# EAGLE design baza (EAGLE 6.1)
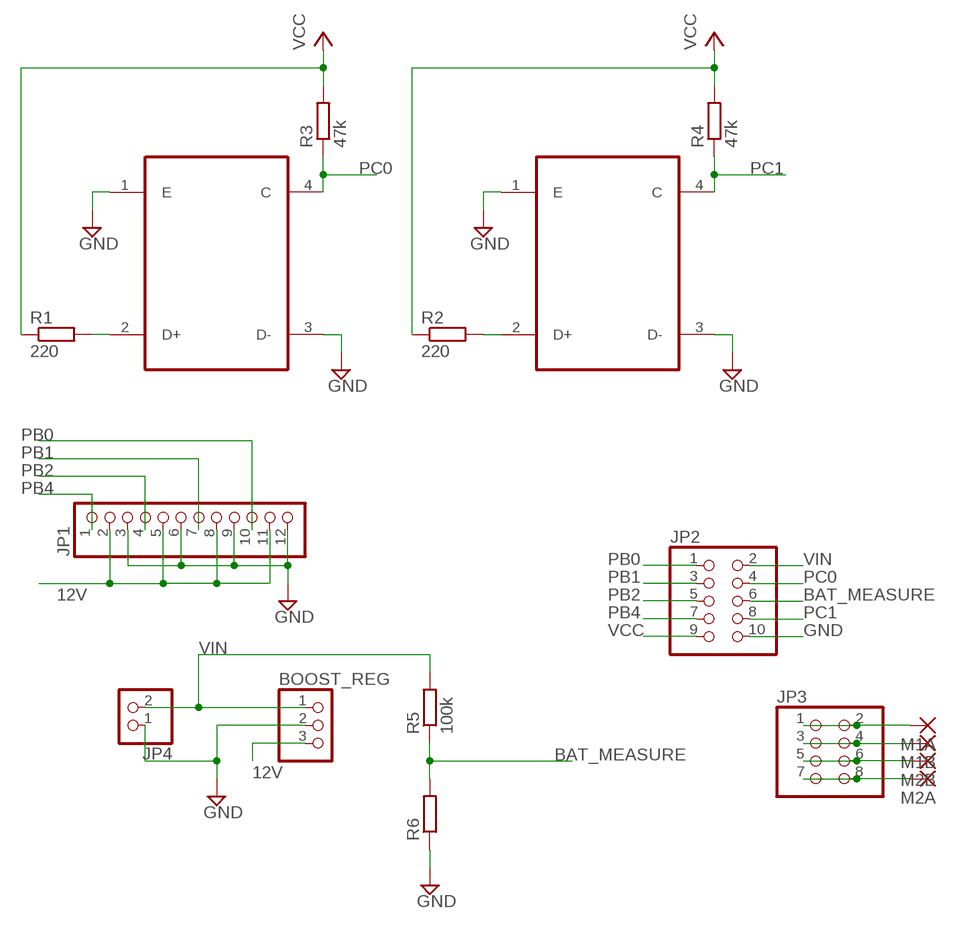
[diagram p0: schematic, sheet 1]

## Parts
BOOST_REG  PINHD-1X3  [1X03]
IR1  TCNT2000  [TCNT2000]
IR2  TCNT2000  [TCNT2000]
JP1  PINHD-1X12-CB  [1X12-CB]
JP2  PINHD-2X5  [2X05]
JP3  PINHD-2X4  [2X04]
JP4  PINHD-1X2  [1X02]
M1A  2,15/1,0  [2,15/1,0]
M1B  2,15/1,0  [2,15/1,0]
M2A  2,15/1,0  [2,15/1,0]
M2B  2,15/1,0  [2,15/1,0]
R1  220  R-EU_M1206  [M1206]
R2  220  R-EU_M1206  [M1206]
R3  47k  R-EU_M1206  [M1206]
R4  47k  R-EU_M1206  [M1206]
R5  100k  R-EU_R1206  [R1206]
R6  R-EU_R1206  [R1206]

## Nets
12V: BOOST_REG.3 JP1.2 JP1.5 JP1.8 JP1.11
BAT_MEASURE: JP2.6 R5.1 R6.2
GND: BOOST_REG.2 IR1.1(E) IR1.3(D-) IR2.1(E) IR2.3(D-) JP1.3 JP1.6 JP1.9 JP1.12 JP2.10 JP4.1 R6.1
N$1: IR1.2(D+) R1.2
N$3: JP3.1 JP3.2 M1A.1(P)
N$4: IR2.2(D+) R2.2
N$5: JP3.3 JP3.4 M1B.1(P)
N$6: JP3.5 JP3.6 M2B.1(P)
N$7: JP3.7 JP3.8 M2A.1(P)
PB0: JP1.10 JP2.1
PB1: JP1.7 JP2.3
PB2: JP1.4 JP2.5
PB4: JP1.1 JP2.7
PC0: IR1.4(C) JP2.4 R3.1
PC1: IR2.4(C) JP2.8 R4.1
VCC: JP2.9 R1.1 R2.1 R3.2 R4.2
VIN: BOOST_REG.1 JP2.2 JP4.2 R5.2

## Library data of the parts
BOOST_REG = adafruit:PINHD-1X3: PIN HEADER
IR1 IR2 = TCNT2000:TCNT2000: The TCNT2000 is a reflective sensor in a miniature SMD package. It has a compact construction where the emitting light source and the detector are arranged in the same plane FEATURES • Package type: SMD • Detector type: phototransistor • Dimensions (L x W x H in mm): 3.4 x 2.7 x 1.5 • Operating range within > 20 % relative collector current: 0.2 mm to 5 mm • Emitter wavelength: 940 nm • Moisture sensitivity level (MSL): 3 APPLICATIONS • Position sensor • Optical switch • Optical encoder (e.g. disc and tape drives for DVD and/or camera applications) • Object detection (e.g. paper presence in printer and copy machines)
JP1 = adafruit:PINHD-1X12: PIN HEADER
JP2 = pinhead:PINHD-2X5: PIN HEADER
JP3 = pinhead:PINHD-2X4: PIN HEADER
JP4 = pinhead:PINHD-1X2: PIN HEADER
M1A M1B M2A M2B = wirepad:2,15/1,0: THROUGH-HOLE PAD
R1-R6 = resistor:R-EU_: RESISTOR, European symbol

## Board
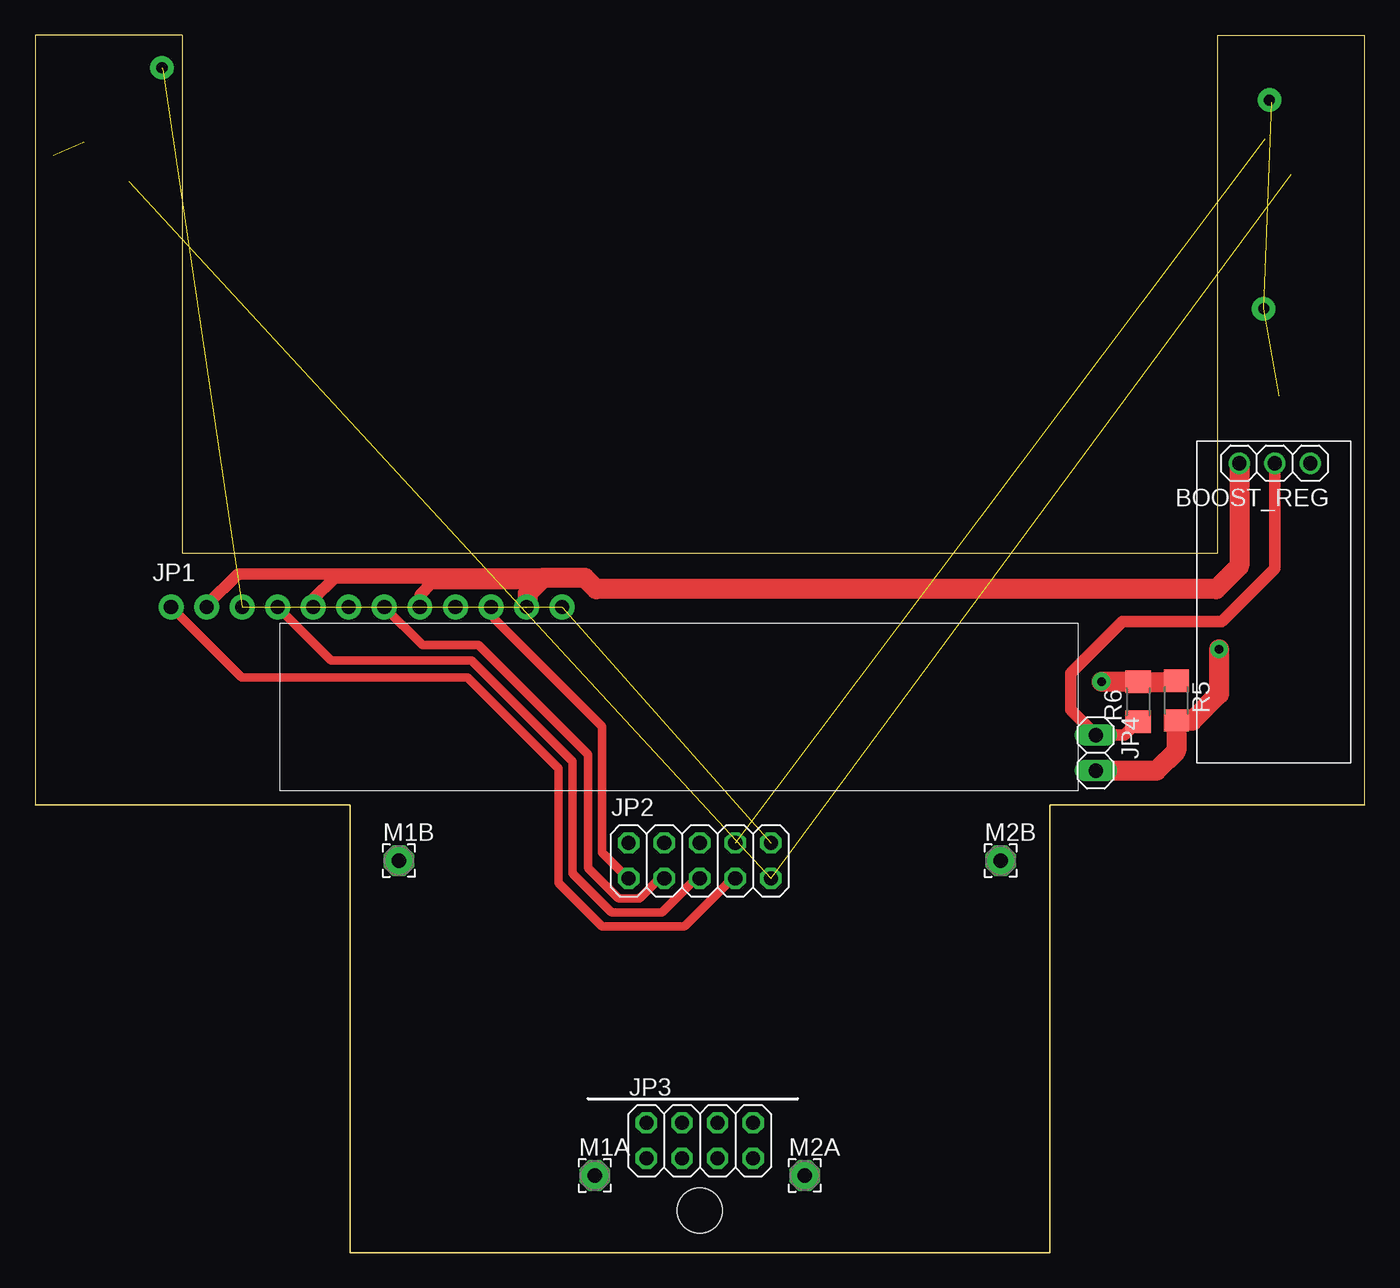
[diagram p1: board, top side]
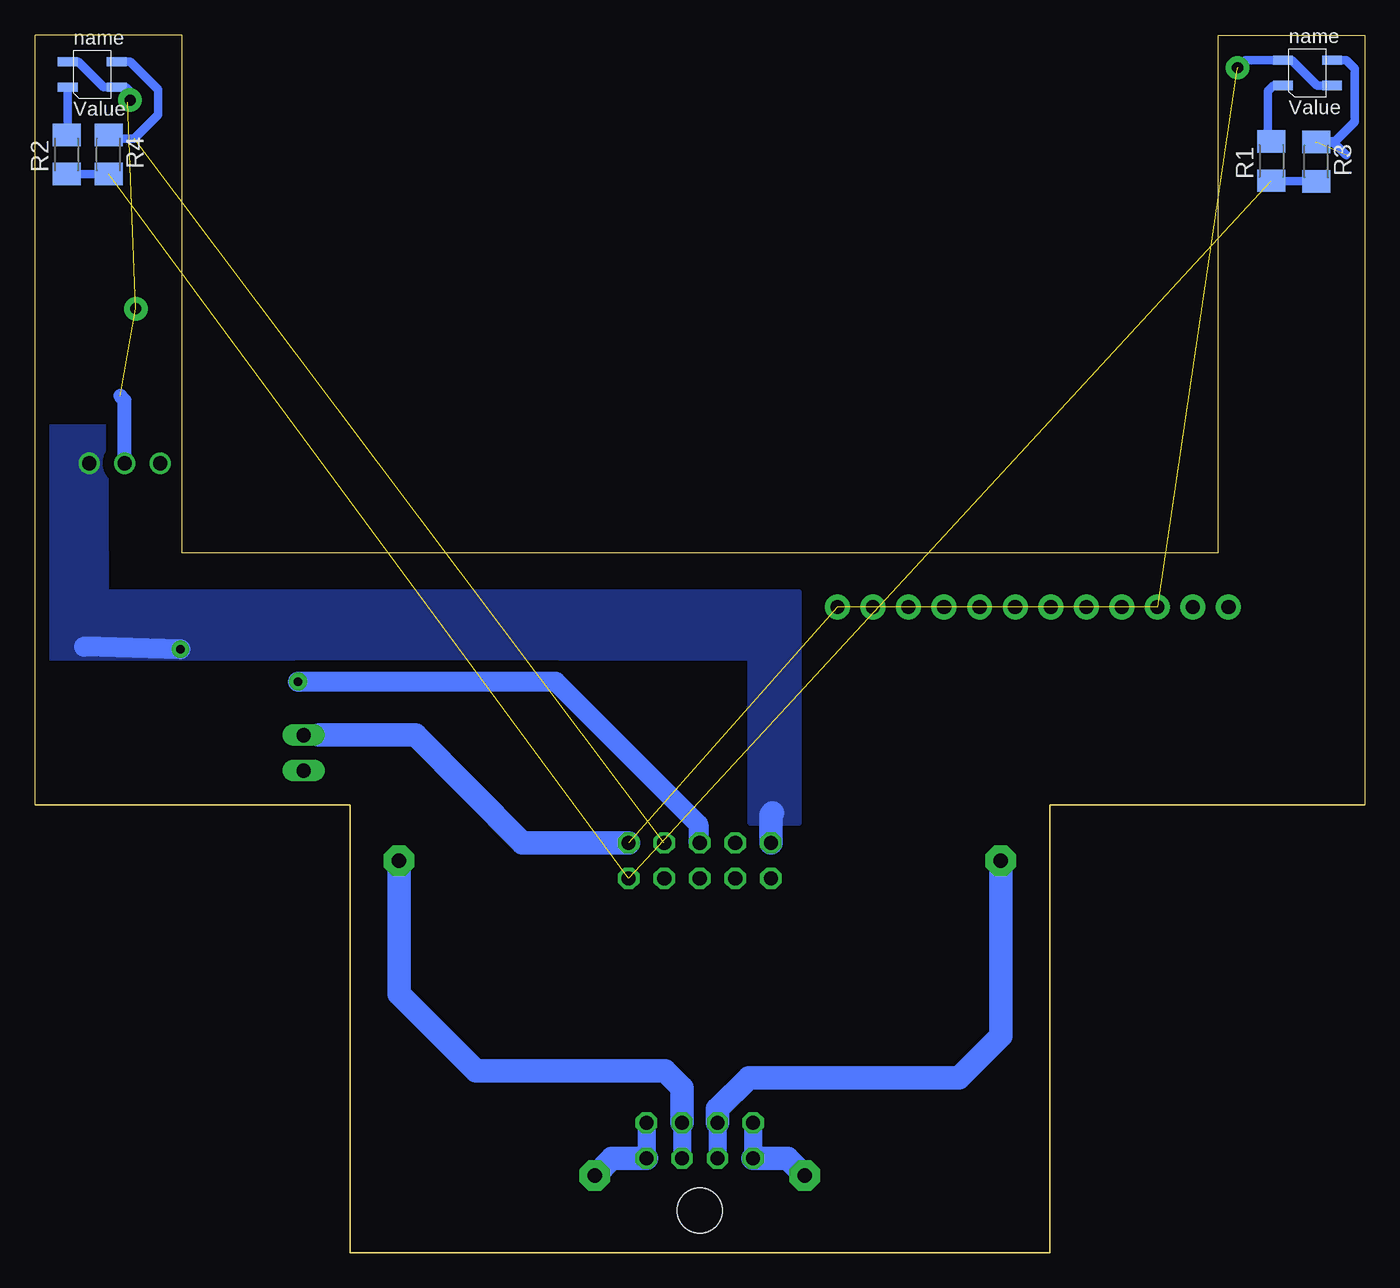
[diagram p2: board, bottom side, seen from below]

Size 95 x 87 mm. Coordinates in mm from the lower left corner, seen from the top.
Outline: 95,32 95,87 84.5,87 84.5,50 10.5,50 10.5,87 0,87 0,32 22.5,32 22.5,0 72.5,0 72.5,32 95,32
Copper layers (1*16): Top 0.035mm / dielectric 1.5mm / Bottom 0.035mm
Design rules: minimum track width 10mil, minimum drill 24mil, track to track 8mil, track to pad 8mil, pad to pad 8mil, via to via 8mil, smd to smd 8mil, copper to edge 40mil, drill to drill 8mil, minimum pad ring 10mil, minimum via ring 8mil, stop-mask expansion 4mil, vias tented up to drill 0mil, thermal gap 10mil
Holes 3.2 mm at 47.5,3

### Footprints (pad centres in the part's own frame; a part is rotated, then mirrored left to right if it is on the bottom)
1X03 = drill 1.016: 1 -2.54,0; 2 0,0; 3 2.54,0
TCNT2000 = smd 1.4 x 0.65: 1 -1.67,1.33; 2 -1.67,-0.47; 3 1.83,-0.47; 4 1.83,1.33
1X12-CB = drill 1.016 pad 1.778: 1 -13.97,0; 2 -11.43,0; 3 -8.89,0; 4 -6.35,0; 5 -3.81,0; 6 -1.27,0; 7 1.27,0; 8 3.81,0; 9 6.35,0; 10 8.89,0; 11 11.43,0; 12 13.97,0
2X05 = drill 1.016 octagon: 1 -5.08,-1.27; 2 -5.08,1.27; 3 -2.54,-1.27; 4 -2.54,1.27; 5 0,-1.27; 6 0,1.27; 7 2.54,-1.27; 8 2.54,1.27; 9 5.08,-1.27; 10 5.08,1.27
2X04 = drill 1.016 octagon: 1 -3.81,-1.27; 2 -3.81,1.27; 3 -1.27,-1.27; 4 -1.27,1.27; 5 1.27,-1.27; 6 1.27,1.27; 7 3.81,-1.27; 8 3.81,1.27
1X02 = drill 1.016 long: 1 -1.27,0; 2 1.27,0
2,15/1,0 = drill 1.016 pad 2.159 octagon: 1 0,0
M1206 = smd 1.6 x 2: 1 -1.4,0; 2 1.4,0
R1206 = smd 1.6 x 1.803: 1 -1.422,0; 2 1.422,0

### Placement (x,y rotation side)
BOOST_REG  88.59,56.4 180 top
IR1  4.16,83.86 0 bottom
IR2  90.99,83.75 0 bottom
JP1  23.69,46.13 0 top
JP2  47.5,28 0 top
JP3  47.5,8 0 top
JP4  75.8,35.7 270 top
M1A  40,5.5 0 top
M1B  26,28 0 top
M2A  55,5.5 0 top
M2B  69,28 0 top
R1  6.65,77.99 90 bottom
R2  92.75,78.47 90 bottom
R3  3.45,77.95 270 bottom
R4  89.75,78.47 270 bottom
R5  81.55,39.44 270 top
R6  78.82,39.36 90 top

### Tracks (layer width: path | path; a pad name or v marks a point on that pad's centre or on a via)
12V  (1 unrouted)
  Top 0.813: JP1.8 27.5,47 28.3,47.8 35.7,47.8 35.8,47.7 | JP1.5 19.88,46.68 21.4,48.2 36.5,48.2 36.6,48.2 36.9,48.5 | JP1.2 12.26,46.26 14.5,48.5 36.9,48.5 | 36.9,48.5 37.2,48.5 37.4,48.3
  Top 1.422: BOOST_REG.3 86.05,49.05 84.4,47.4 40.1,47.4 39.3,48.2 36.5,48.2 36.3,48.2 35.8,47.7 35.2,47.1 35.2,46.2 35.1,46.1
BAT_MEASURE  (via drill 0.6 pad 1.27)
  Top 1.422: R5.1 81.47,40.78 R6.2 76.22,40.78 v76.2,40.8
  Bottom 1.422: v76.2,40.8 57.8,40.8 47.6,30.6 47.6,29.37 JP2.6
GND  (via drill 0.8 pad 1.68)  (8 unrouted)
  Top 0.61: v88.2,82.35 88.23,82.35 88.38,82.2
  Top 0.813: R6.1 77.85,36.97 JP4.1 74,38.77 74,41.4 77.7,45.1 84.8,45.1 88.59,48.89 BOOST_REG.2
  Bottom 0.61: IR1.3 3.39,83.39 5.2,85.2 IR1.1 | IR1.1 | IR2.1 92.64,85.1 91.9,85.1 90.08,83.28 IR2.3 88.53,83.28 88.21,82.96 v88.21,82.36 v88.2,82.35 | IR1.1 8.53,85.2 9.13,84.6
  Bottom 1.016: BOOST_REG.2 88.59,60.89 88.9,61.2
  Bottom 1.27: 73.43,36.97 74,37
  Bottom 1.422: JP4.1 74.13,36.97 74.7,37
  Bottom 1.676: JP2.10 60.17,29.27 67.8,37 74,37 74.7,37
  other vias: 9.07,84.66 87.8,67.44
N$1
  Bottom 0.61: IR1.2 6.51,83.39 6.9,83 6.9,79.6 6.7,79.4 R1.2
N$3
  Bottom 1.27: JP3.2 JP3.1
  Bottom 1.676: JP3.1 41.23,6.73 M1A.1
N$4
  Bottom 0.61: IR2.2 92.66,79.81 R2.2
N$5
  Bottom 1.27: JP3.4 JP3.3
  Bottom 1.676: JP3.4 46.23,10.27 44,12.5 29,12.5 26,15.5 M1B.1
N$6
  Bottom 1.27: JP3.6 JP3.5
  Bottom 1.676: JP3.6 48.77,11.77 50,13 63.5,13 69,18.5 M2B.1
N$7
  Bottom 1.27: JP3.8 JP3.7
  Bottom 1.676: JP3.7 53.77,6.73 M2A.1
PB0
  Top 0.61: JP2.1 42.37,26.73 40.5,28.6 40.5,37.6 32.8,45.3 32.8,45.91 JP1.10
PB1
  Top 0.61: JP2.3 44.63,26.73 43.2,25.3 41.7,25.3 39.5,27.5 39.5,35.6 31.7,43.4 27.69,43.4 JP1.7
PB2
  Top 0.61: JP2.5 47.23,26.73 44.8,24.3 41.2,24.3 38.4,27.1 38.4,35.1 31.2,42.3 21.17,42.3 JP1.4
PB4
  Top 0.61: JP2.7 49.83,26.73 46.4,23.3 40.5,23.3 37.4,26.4 37.4,34.6 30.9,41.1 14.75,41.1 JP1.1
PC0  (2 unrouted)
  Bottom 0.61: IR1.4 1.29,85.19 0.7,84.6 0.7,80.8 2.1,79.4 3.6,79.4 3.5,79.3 2.2,79.3 1.3,78.4
PC1  (1 unrouted)
  Bottom 0.61: IR2.4 88.18,85.08 86.2,83.1 86.2,81.3 87.9,79.6 89.48,79.6 R4.1
VCC  (2 unrouted)
  Bottom 0.61: R2.1 R4.2 | R3.2 6.71,76.55 R1.1
VIN  (via drill 0.6 pad 1.27)
  Top 1.422: JP4.2 80.13,34.43 81.55,35.85 R5.2 81.57,38 82.7,38 84.6,39.9 v84.6,43.1
  Bottom 1.422: v84.6,43.1 91.5,43.3
  Bottom 1.676: JP2.2 42.42,31.28 42.3,31.4
  pour Bottom (isolate 0.813, rank 4, no thermals): 90,59 96.5,59 96.5,42.5 43.9,42.5 43.9,30.7 40.4,30.7 40.4,47.2 89.9,47.2